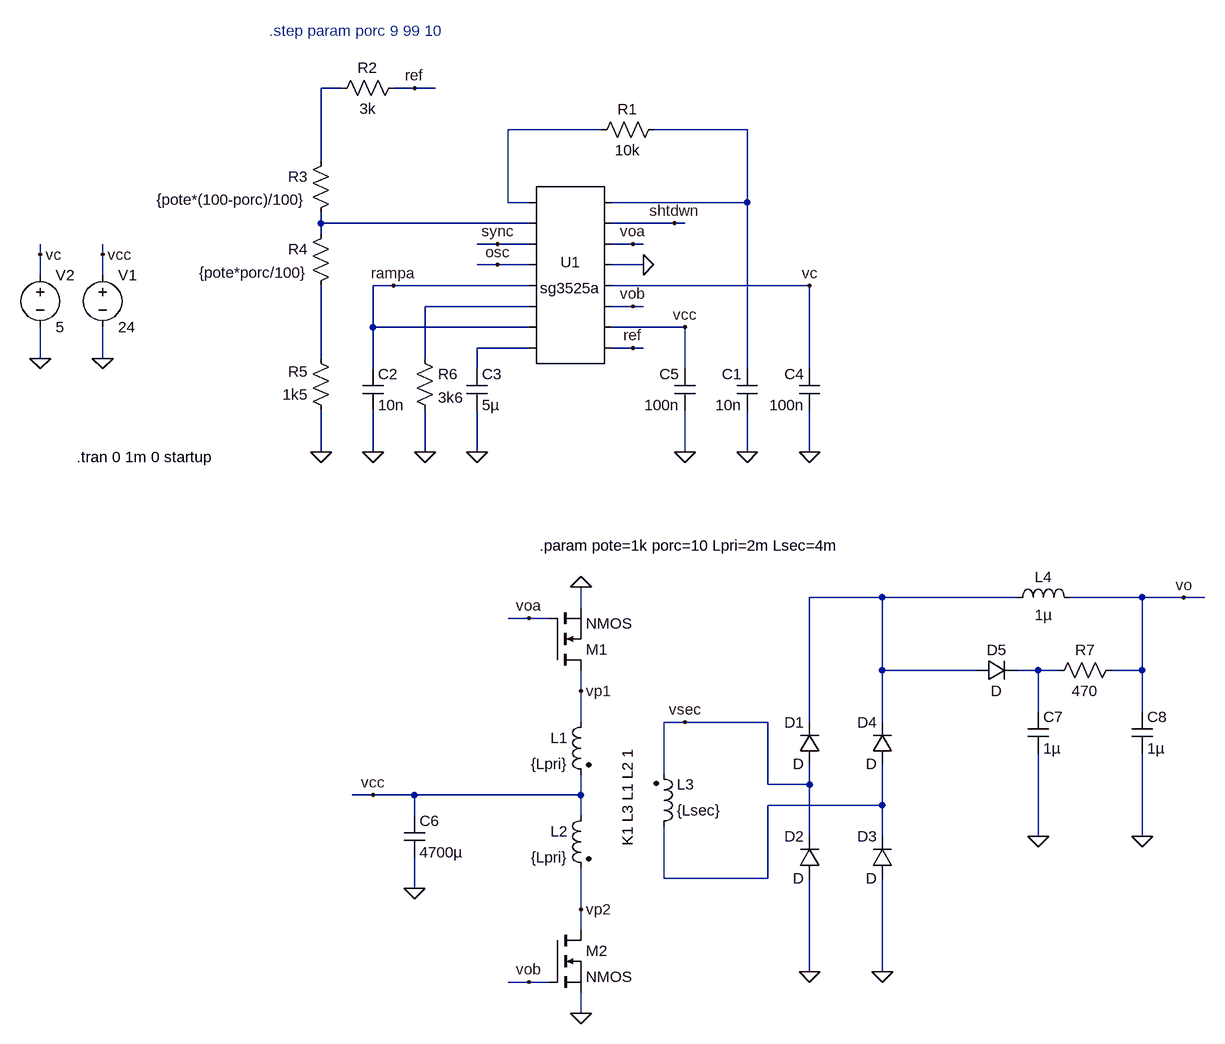
[diagram p0: schematic convDCACDC.asc]
* convDCACDC.asc
* U1: sg3525a (symbol AutoGenerated\sg3525a not available, pins judged from their places): pin1=N002 pin2=N004 pin3=sync pin4=osc pin5=rampa pin6=N005 pin7=rampa pin8=N006 pin9=N003 pin10=shtdwn pin11=voa pin12=0 pin13=vc pin14=vob pin15=vcc pin16=ref
R1 N003 N002 10k
C1 0 N003 10n
R2 ref N001 3k
R3 N001 N004 {pote*(100-porc)/100}
R4 N004 N007 {pote*porc/100}
R5 0 N007 1k5
C2 rampa 0 10n
R6 N005 0 3k6
C3 N006 0 5µ
C4 0 vc 100n
C5 0 vcc 100n
V1 vcc 0 24
V2 vc 0 5
C6 vcc 0 4700µ
M1 vp1 voa 0 0 NMOS
M2 vp2 vob 0 0 NMOS
L1 vp1 vcc {Lpri}
L2 vcc vp2 {Lpri}
L3 N010 vsec {Lsec}
D1 vsec N008 D
D2 0 vsec D
D3 0 N010 D
D4 N010 N008 D
D5 N008 N009 D
L4 N008 vo 1µ
R7 vo N009 470
C7 N009 0 1µ
C8 vo 0 1µ
.model D D
.lib standard.dio
.model NMOS NMOS
.model PMOS PMOS
.lib standard.mos
.param pote=1k porc=10 Lpri=2m Lsec=4m
.tran 0 1m 0 startup
* .step param porc 9 99 10
K1 L3 L1 L2 1
.backanno
.end

* Results of the author's LTspice run, read from the files saved beside the schematic
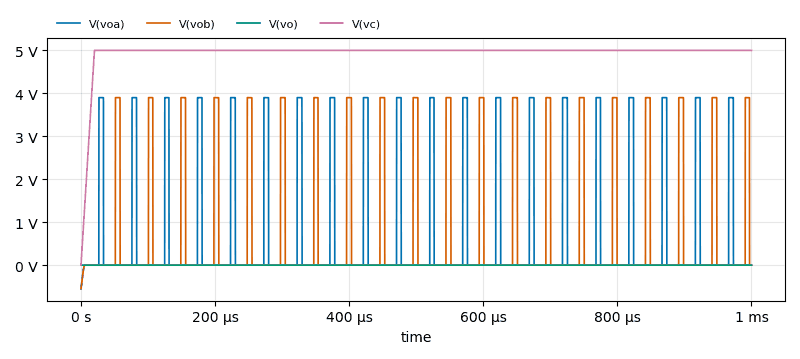
[diagram p1: Transient Analysis of convDCACDC.asc, plotted from the saved traces]
* Transient Analysis, 1 run:
*   V(voa): min -550 mV, max 3.9 V, average 539.6 mV, rms 1.45 V, last 127.8 µV
*   V(vob): min -550 mV, max 3.9 V, average 542.4 mV, rms 1.454 V, last 127.8 µV
*   V(vo): min 0 V, max 819.5 µV, average 439.9 µV, rms 496.7 µV, last 817.7 µV
*   V(vc): min 0 V, max 5 V, average 4.95 V, rms 4.967 V, last 5 V